# EAGLE design M044B (EAGLE 6.6.0)
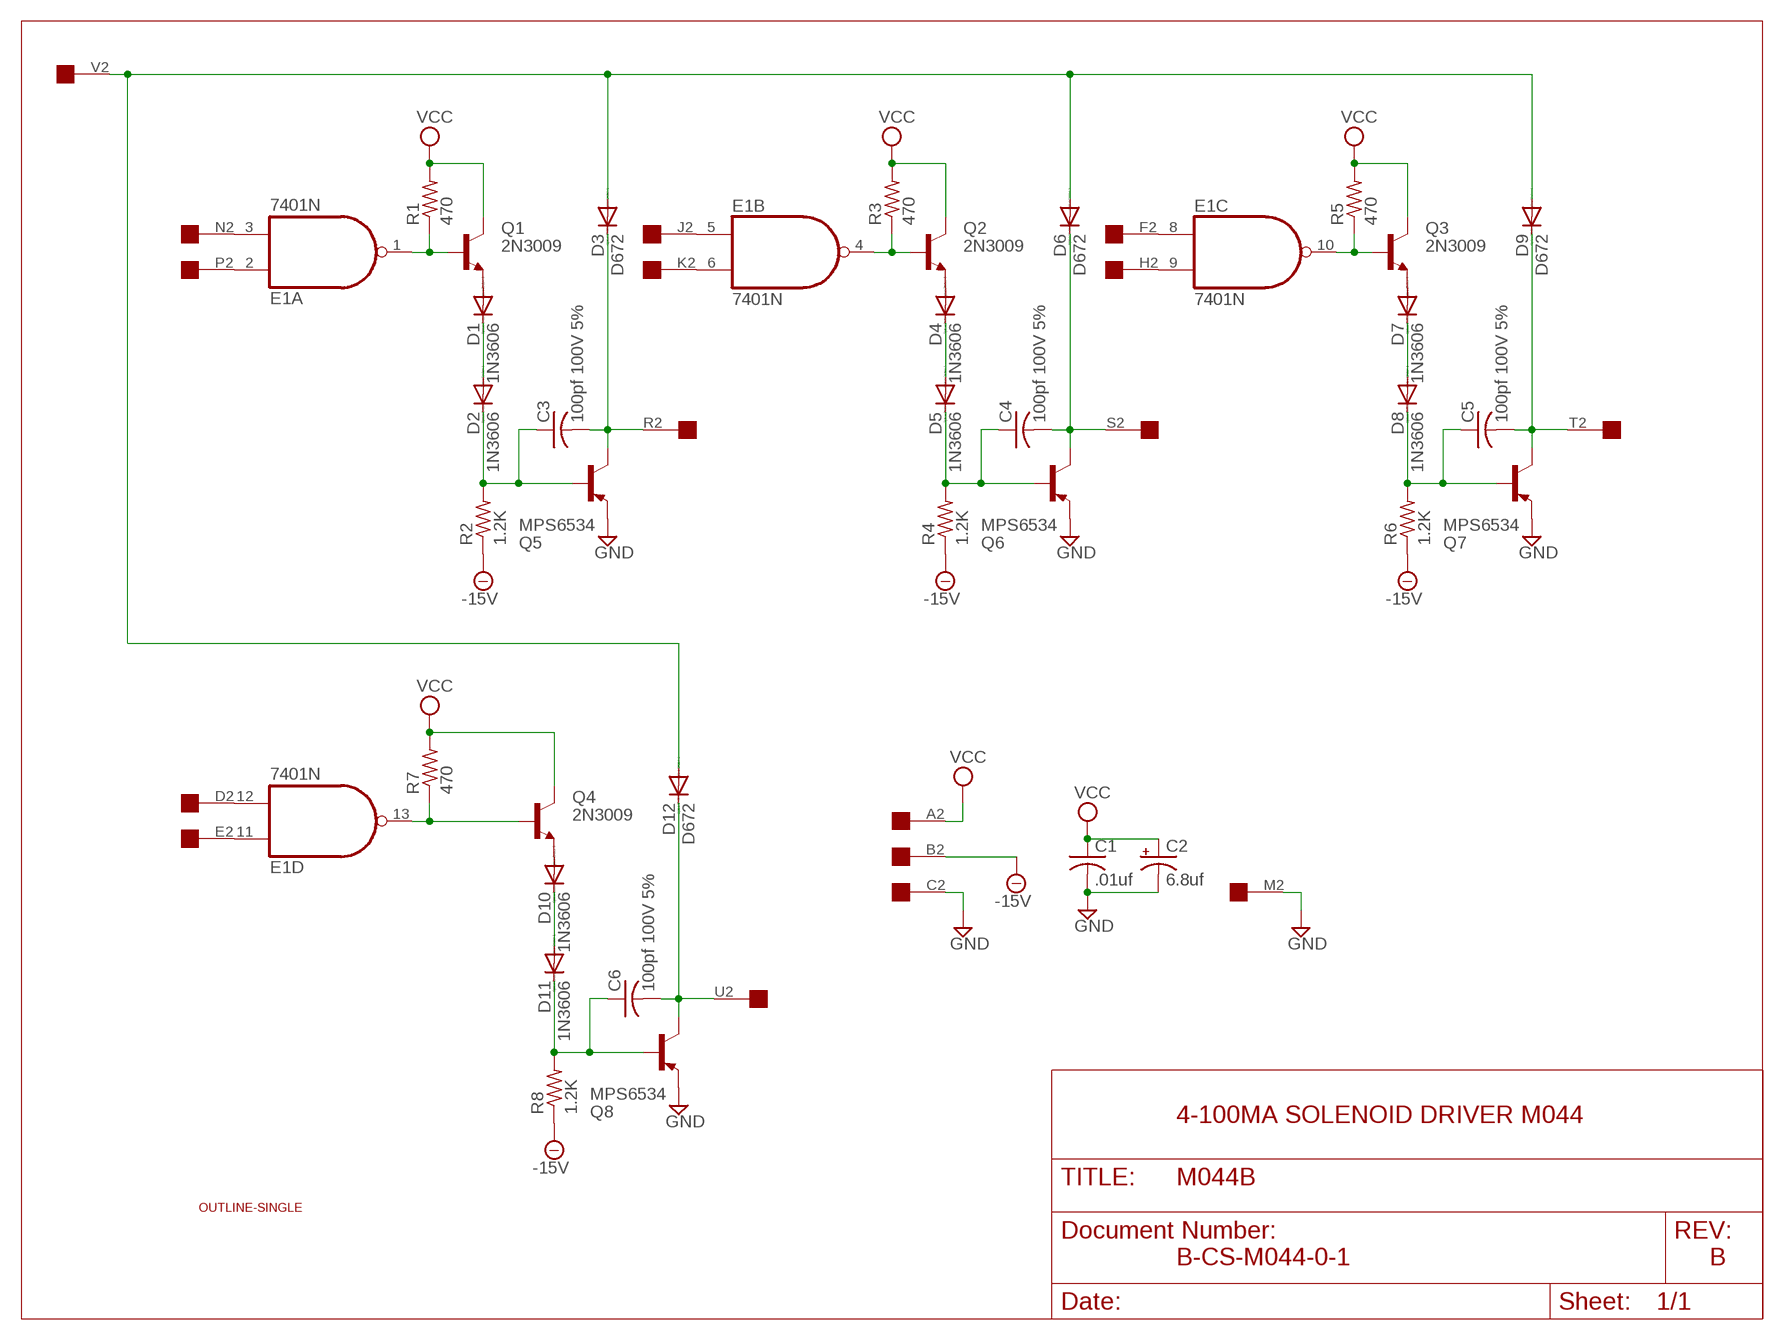
[diagram p0: schematic, sheet 1]

## Parts
C1  .01uf  C-US050-025X075  [C050-025X075]
C2  6.8uf  CPOL-USE15-5AXIAL  [E15-5]
C3  100pf 100V 5%  C-US050-025X075  [C050-025X075]
C4  100pf 100V 5%  C-US050-025X075  [C050-025X075]
C5  100pf 100V 5%  C-US050-025X075  [C050-025X075]
C6  100pf 100V 5%  C-US050-025X075  [C050-025X075]
D1  1N3606  1N4148DO35-10  [DO35-10]
D2  1N3606  1N4148DO35-10  [DO35-10]
D3  D672  1N4148DO35-10  [DO35-10]
D4  1N3606  1N4148DO35-10  [DO35-10]
D5  1N3606  1N4148DO35-10  [DO35-10]
D6  D672  1N4148DO35-10  [DO35-10]
D7  1N3606  1N4148DO35-10  [DO35-10]
D8  1N3606  1N4148DO35-10  [DO35-10]
D9  D672  1N4148DO35-10  [DO35-10]
D10  1N3606  1N4148DO35-10  [DO35-10]
D11  1N3606  1N4148DO35-10  [DO35-10]
D12  D672  1N4148DO35-10  [DO35-10]
E1  7401N  74LS01N  [DIL14]
Q1  2N3009  2N3019  [TO39]
Q2  2N3009  2N3019  [TO39]
Q3  2N3009  2N3019  [TO39]
Q4  2N3009  2N3019  [TO39]
Q5  MPS6534  2N2904-PNP-TO39-EBC  [TO39]
Q6  MPS6534  2N2904-PNP-TO39-EBC  [TO39]
Q7  MPS6534  2N2904-PNP-TO39-EBC  [TO39]
Q8  MPS6534  2N2904-PNP-TO39-EBC  [TO39]
R1  470  R-US_0207/10  [0207/10]
R2  1.2K  R-US_0207/10  [0207/10]
R3  470  R-US_0207/10  [0207/10]
R4  1.2K  R-US_0207/10  [0207/10]
R5  470  R-US_0207/10  [0207/10]
R6  1.2K  R-US_0207/10  [0207/10]
R7  470  R-US_0207/10  [0207/10]
R8  1.2K  R-US_0207/10  [0207/10]
U$1  OUTLINE-SINGLE  [SINGLE]
U$2  EDGE-1  [EDGE-CON1]

## Nets
-15V [Supply]: R2.1 R4.1 R6.1 R8.1 U$2.B2
GND [Supply]: C1.2 C2.- Q5.1(E) Q6.1(E) Q7.1(E) Q8.1(E) U$2.C2 U$2.M2
N$1: E1.3(A:I1) U$2.N2
N$2: E1.2(A:I0) U$2.P2
N$3: E1.1(A:O) Q1.2(B) R1.1
N$4: D1.A Q1.1(E)
N$5: D1.C D2.A
N$6: C3.1 D2.C Q5.2(B) R2.2
N$7: C3.2 D3.C Q5.3(C) U$2.R2
N$8: D3.A D6.A D9.A D12.A U$2.V2
N$9: E1.4(B:O) Q2.2(B) R3.1
N$10: D4.A Q2.1(E)
N$11: D4.C D5.A
N$12: C4.1 D5.C Q6.2(B) R4.2
N$13: C4.2 D6.C Q6.3(C) U$2.S2
N$14: E1.5(B:I0) U$2.J2
N$15: E1.6(B:I1) U$2.K2
N$16: E1.10(C:O) Q3.2(B) R5.1
N$17: D7.A Q3.1(E)
N$18: D7.C D8.A
N$19: C5.1 D8.C Q7.2(B) R6.2
N$20: C5.2 D9.C Q7.3(C) U$2.T2
N$21: E1.13(D:O) Q4.2(B) R7.1
N$22: E1.9(C:I1) U$2.H2
N$23: E1.8(C:I0) U$2.F2
N$24: D10.A Q4.1(E)
N$25: D10.C D11.A
N$26: C6.1 D11.C Q8.2(B) R8.2
N$27: C6.2 D12.C Q8.3(C) U$2.U2
N$28: E1.11(D:I0) U$2.E2
N$29: E1.12(D:I1) U$2.D2
VCC [Supply]: C1.1 C2.+ Q1.3(C) Q2.3(C) Q3.3(C) Q4.3(C) R1.2 R3.2 R5.2 R7.2 U$2.A2
Unconnected: U$2.L2

## Notes on the sheet
- 4-100MA SOLENOID DRIVER M044
- B-CS-M044-0-1 | B

## Power pins joined to a net without a drawn wire
GND: E1.7(P:GND)
VCC: E1.14(P:VCC)

## Library data of the parts
C1 C3-C6 = rcl:C-US: CAPACITOR, American symbol
C2 = rcl:CPOL-US: POLARIZED CAPACITOR, American symbol
D1-D12 = diode:1N4148: DIODE high speed (Philips)
E1 = 74xx-us:74*01: Quad 2-input NAND gate, open collector
Q1-Q4 = transistor-npn:2N3019: NPN Transistor
Q5-Q8 = transistor:*-PNP-: PNP Transistror
R1-R8 = rcl:R-US_: RESISTOR, American symbol
U$1 = dec-con:OUTLINE-*: Board outlines for DEC boards.
U$2 = dec-con:EDGE-1: Single-Sided DEC Edge Connector -- (side 2)

## Net classes
1 Supply: width 0.813 mm

## Board
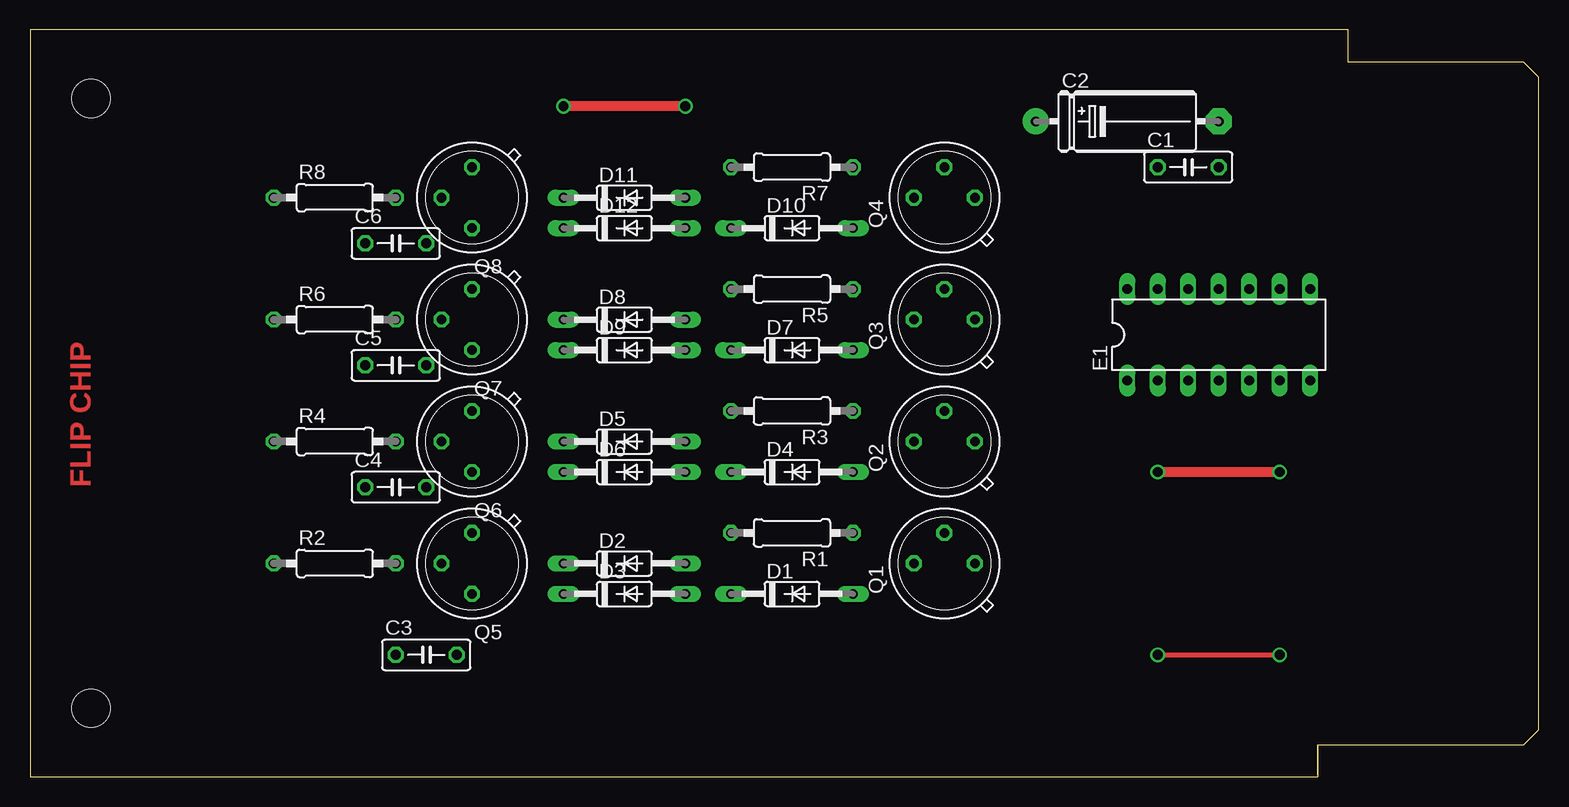
[diagram p1: board, top side]
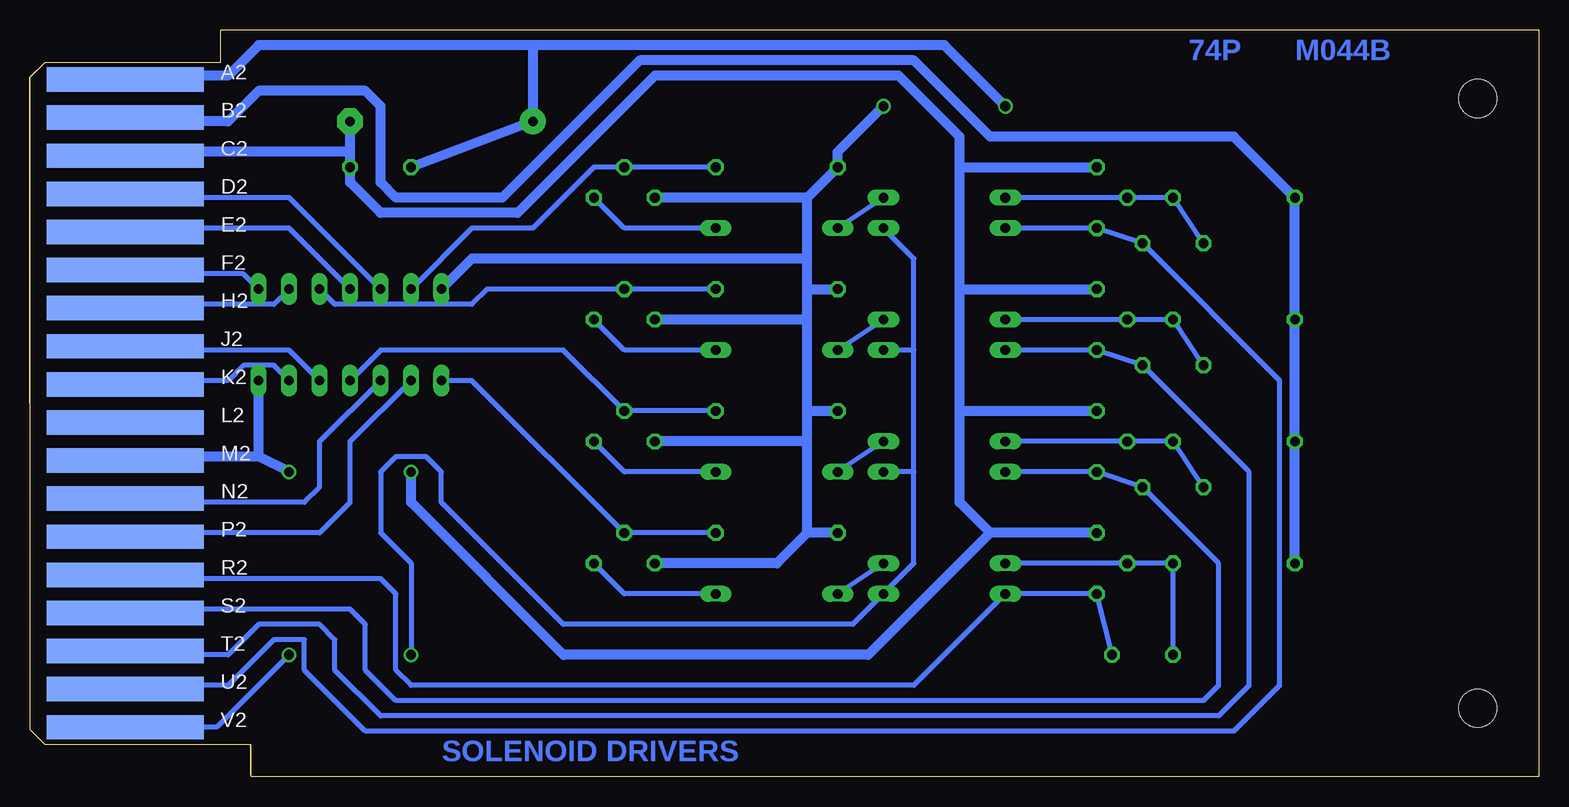
[diagram p2: board, bottom side, seen from below]

Size 125.73 x 62.23 mm. Coordinates in mm from the lower left corner, seen from the top.
Copper layers (1+16): Top 0.035mm / dielectric 1.5mm / Bottom 0.035mm
Design rules "16mils": minimum track width 16mil, minimum drill 32mil, track to track 15mil, track to pad 10mil, pad to pad 10mil, via to via 10mil, smd to smd 10mil, copper to edge 13mil, drill to drill 10mil, minimum pad ring 10mil, minimum via ring 8mil, stop-mask expansion 0mil, vias tented up to drill 0mil, thermal gap 10mil

### Footprints (pad centres in the part's own frame; a part is rotated, then mirrored left to right if it is on the bottom)
C050-025X075 = drill 0.813 octagon: 1 -2.54,0; 2 2.54,0
E15-5 = drill 0.813 pad 2.159: + -7.62,0 | drill 0.813 pad 2.159 octagon: - 7.62,0
DO35-10 = drill 0.813 long: A 5.08,0; C -5.08,0
DIL14 = drill 0.813 long: 1 -7.62,-3.81; 2 -5.08,-3.81; 3 -2.54,-3.81; 4 0,-3.81; 5 2.54,-3.81; 6 5.08,-3.81; 7 7.62,-3.81; 8 7.62,3.81; 9 5.08,3.81; 10 2.54,3.81; 11 0,3.81; 12 -2.54,3.81; 13 -5.08,3.81; 14 -7.62,3.81
TO39 = drill 0.813 octagon: 1 0,-2.54; 2 2.54,0; 3 0,2.54
0207/10 = drill 0.813 octagon: 1 -5.08,0; 2 5.08,0
SINGLE = hole 3.175: 120.65,56.515; 120.65,5.715
EDGE-CON1 = smd 13.106 x 2.032 bottom: A2 7.938,4.128; B2 7.938,7.303; C2 7.938,10.477; D2 7.938,13.652; E2 7.938,16.828; F2 7.938,20.003; H2 7.938,23.177; J2 7.938,26.352; K2 7.938,29.527; L2 7.938,32.703; M2 7.938,35.877; N2 7.938,39.053; P2 7.938,42.227; R2 7.938,45.403; S2 7.938,48.578; T2 7.938,51.752; U2 7.938,54.928; V2 7.938,58.102

### Placement (x,y rotation side)
C1  96.52,50.8 0 top
C2  91.44,54.61 0 top
C3  33.02,10.16 0 top
C4  30.48,24.13 0 top
C5  30.48,34.29 0 top
C6  30.48,44.45 0 top
D1  63.5,15.24 0 top
D2  49.53,17.78 0 top
D3  49.53,15.24 0 top
D4  63.5,25.4 0 top
D5  49.53,27.94 0 top
D6  49.53,25.4 0 top
D7  63.5,35.56 0 top
D8  49.53,38.1 0 top
D9  49.53,35.56 0 top
D10  63.5,45.72 0 top
D11  49.53,48.26 0 top
D12  49.53,45.72 0 top
E1  99.06,36.83 0 top
Q1  76.2,17.78 90 top
Q2  76.2,27.94 90 top
Q3  76.2,38.1 90 top
Q4  76.2,48.26 90 top
Q5  36.83,17.78 180 top
Q6  36.83,27.94 180 top
Q7  36.83,38.1 180 top
Q8  36.83,48.26 180 top
R1  63.5,20.32 180 top
R2  25.4,17.78 0 top
R3  63.5,30.48 180 top
R4  25.4,27.94 0 top
R5  63.5,40.64 180 top
R6  25.4,38.1 0 top
R7  63.5,50.8 180 top
R8  25.4,48.26 0 top
U$1  125.73,62.23 180 top
U$2  125.73,62.23 180 top

### Tracks (layer width: path | path; a pad name or v marks a point on that pad's centre or on a via)
-15V
  Bottom 0.813: U$2.B2 111.76,54.61 109.22,54.61 106.68,57.15 97.79,57.15 96.52,55.88 96.52,49.53 95.25,48.26 86.36,48.26 74.93,59.69 52.07,59.69 45.72,53.34 25.4,53.34 R8.1 R6.1 R4.1 R2.1
GND  (via drill 0.81)
  Top 0.813: v93.98,25.4 v104.14,25.4
  Bottom 0.813: U$2.C2 111.76,52.07 99.06,52.07 | 99.06,52.07 C1.2 99.06,49.53 96.52,46.99 85.09,46.99 73.66,58.42 53.34,58.42 48.26,53.34 48.26,50.8 | 99.06,52.07 C2.- | 48.26,30.48 48.26,22.86 45.72,20.32 | 48.26,30.48 48.26,40.64 | 48.26,40.64 48.26,50.8 | Q5.1 45.72,20.32 | 48.26,30.48 Q6.1 | 48.26,40.64 Q7.1 | 48.26,50.8 Q8.1 | U$2.M2 112.7,26.34 111.76,26.67 106.68,26.67 | v104.14,25.4 106.68,26.67 | 106.68,26.67 E1.7 | v93.98,25.4 93.98,22.86 81.28,10.16 55.88,10.16 45.72,20.32
N$1
  Bottom 0.406: U$2.N2 112.09,23.19 111.76,22.86 102.87,22.86 101.6,24.13 101.6,27.94 E1.3
N$2
  Bottom 0.406: U$2.P2 112.09,19.99 111.76,20.32 101.6,20.32 99.06,22.86 99.06,27.94 E1.2
N$3
  Bottom 0.406: R1.1 Q1.2 88.9,33.02 E1.1
N$4
  Bottom 0.406: D1.A 76.2,15.24 Q1.1
N$5
  Bottom 0.406: D2.A D1.C
N$6
  Bottom 0.406: C3.1 R2.2 Q5.2 D2.C
N$7
  Bottom 0.406: C3.2 Q5.3 D3.C 52.07,7.62 93.98,7.62 95.25,8.89 95.25,15.24 96.52,16.51 111.76,16.51 112.09,16.84 U$2.R2
N$8  (via drill 0.81)
  Top 0.406: v93.98,10.16 v104.14,10.16
  Bottom 0.406: U$2.V2 110.17,4.13 v104.14,10.16 | v93.98,10.16 93.98,17.78 96.52,20.32 96.52,25.4 95.25,26.67 92.71,26.67 91.44,25.4 91.44,22.86 81.28,12.7 57.15,12.7 D3.A 52.07,17.78 52.07,25.4 | 52.07,25.4 52.07,35.56 | 52.07,35.56 52.07,43.18 D12.A | 52.07,35.56 D9.A | 52.07,25.4 D6.A
N$9
  Bottom 0.406: R3.1 Q2.2 81.28,35.56 96.52,35.56 E1.4
N$10
  Bottom 0.406: D4.A 76.2,25.4 Q2.1
N$11
  Bottom 0.406: D5.A D4.C
N$12
  Bottom 0.406: C4.1 R4.2 Q6.2 D5.C
N$13
  Bottom 0.406: D6.C Q6.3 C4.2 26.67,17.78 26.67,7.62 27.94,6.35 95.25,6.35 97.79,8.89 97.79,12.7 99.06,13.97 111.76,13.97 112.06,13.66 U$2.S2
N$14
  Bottom 0.406: U$2.J2 112.09,35.89 111.76,35.56 104.14,35.56 E1.5
N$15
  Bottom 0.406: U$2.K2 112.06,32.72 111.76,33.02 109.22,33.02 107.95,34.29 105.41,34.29 E1.6
N$16
  Bottom 0.406: R5.1 Q3.2 87.63,40.64 88.9,39.37 100.33,39.37 E1.10
N$17
  Bottom 0.406: D7.A 76.2,35.56 Q3.1
N$18
  Bottom 0.406: D8.A D7.C
N$19
  Bottom 0.406: C5.1 R6.2 Q7.2 D8.C
N$20
  Bottom 0.406: D9.C Q7.3 C5.2 24.13,25.4 24.13,7.62 26.67,5.08 96.52,5.08 100.33,8.89 100.33,11.43 101.6,12.7 106.68,12.7 109.22,10.16 111.76,10.16 112.09,10.49 U$2.T2
N$21
  Bottom 0.406: R7.1 Q4.2 78.74,50.8 83.82,45.72 88.9,45.72 E1.13
N$22
  Bottom 0.406: U$2.H2 112.09,39.04 111.76,39.37 105.41,39.37 E1.9
N$23
  Bottom 0.406: U$2.F2 112.04,42.19 111.76,41.91 107.95,41.91 E1.8
N$24
  Bottom 0.406: D10.A 76.2,45.72 Q4.1
N$25
  Bottom 0.406: D11.A D10.C
N$26
  Bottom 0.406: C6.1 R8.2 Q8.2 D11.C
N$27
  Bottom 0.406: D12.C Q8.3 C6.2 21.59,33.02 21.59,7.62 25.4,3.81 97.79,3.81 102.87,8.89 102.87,11.43 105.41,11.43 109.22,7.62 111.76,7.62 112.12,7.26 U$2.U2
N$28
  Bottom 0.406: U$2.E2 112.09,45.39 111.76,45.72 104.14,45.72 103.81,45.39 E1.11
N$29
  Bottom 0.406: U$2.D2 112.06,48.56 111.76,48.26 104.14,48.26 E1.12
VCC  (via drill 0.81 pad 0.25)
  Top 0.813: v54.61,55.88 v44.45,55.88
  Bottom 0.813: 83.82,60.96 49.53,60.96 v44.45,55.88 | 83.82,60.96 106.68,60.96 109.22,58.42 111.76,58.42 112.14,58.04 U$2.A2 | v54.61,55.88 58.42,52.07 R7.2 60.96,48.26 | 83.82,60.96 C2.+ C1.1 | 60.96,20.32 60.96,27.94 | 60.96,27.94 60.96,30.48 | 60.96,30.48 60.96,38.1 | 60.96,38.1 60.96,40.64 | 60.96,40.64 60.96,43.18 | 60.96,43.18 60.96,48.26 | R1.2 60.96,20.32 | 60.96,30.48 R3.2 | 60.96,40.64 R5.2 | Q1.3 63.5,17.78 60.96,20.32 | 60.96,27.94 Q2.3 | 60.96,38.1 Q3.3 | 60.96,48.26 Q4.3 | E1.14 88.9,43.18 60.96,43.18

### Text on the board
Top: FLIP CHIP
Bottom: M044B | 74P | SOLENOID DRIVERS